# Altium schematic sheet Top.SchDoc: Top
size Letter; SheetNumber: 1; SheetTotal: 1
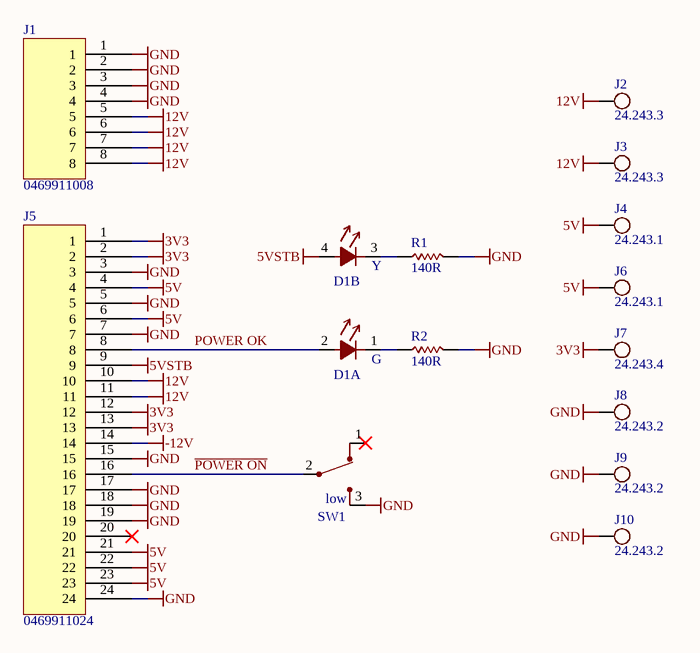
[diagram p0: Top.SchDoc]

## Parts
D1  DUAL INDICATOR 5MM  [Dialight 552-0232F]  (value not drawn)  (parts A,B of 2)
J1  0469911008  [PCIE 8P POWER]
J2  24.243.3  [BANANA YL]  (no BOM)
J3  24.243.3  [BANANA YL]  (no BOM)
J4  24.243.1  [BANANA RD]  (no BOM)
J5  0469911024  [ATX 24P POWER]
J6  24.243.1  [BANANA RD]  (no BOM)
J7  24.243.4  [BANANA GR]  (no BOM)
J8  24.243.2  [BANANA BK]  (no BOM)
J9  24.243.2  [BANANA BK]  (no BOM)
J10  24.243.2  [BANANA BK]  (no BOM)
R1  140R  [0805]
R2  140R  [0805]
SW1  SWITCH  [7101SD9AV2BE]  (value not drawn)

## Nets
3V3: J5.1 J5.2 J5.12 J5.13 J7.1(TP)
5V: J4.1(TP) J5.4 J5.6 J5.21 J5.22 J5.23 J6.1(TP)
5VSTB: D1.4 J5.9
12V: J1.5 J1.6 J1.7 J1.8 J2.1(TP) J3.1(TP) J5.10 J5.11
-12V: J5.14
GND: J1.1 J1.2 J1.3 J1.4 J5.3 J5.5 J5.7 J5.15 J5.17 J5.18 J5.19 J5.24 J8.1(TP) J9.1(TP) J10.1(TP) R1.1 R2.1 SW1.3
~{POWER ON}: J5.16 SW1.2
POWER OK: D1.2 J5.8
NetD1_1: D1.1 R2.2
NetD1_3: D1.3 R1.2

Not connected (* = marked no-connect by the designer): J5 20*; SW1 1*

## Notes on the sheet
- Project:
- Date:
- Author:
- Revision:
- Sheet
- of
- File:
- (in symbol DUAL INDICATOR 5MM, part A) G
- (in symbol DUAL INDICATOR 5MM, part B) Y
- (in symbol SWITCH) low

## Library data of the parts
D1 = DUAL INDICATOR 5MM: Dialight 552-0232F Indicator; Ref: 552-0232F
J1 = PCIE 8P: Molex MiniFit Jr 8 pin, PCIe power connector; Ref: 0469911008
J2 J3 = BANANA YELLOW: Banana jack, PCB mount right angle; Ref: 24.243.3
J4 J6 = BANANA RED: Banana jack, PCB mount right angle; Ref: 24.243.1
J5 = ATX 24P: Molex MiniFit Jr 24 pin, ATX power connector; Ref: 0469911024
J7 = BANANA GREEN: Banana jack, PCB mount right angle; Ref: 24.243.4
J8-J10 = BANANA BLACK: Banana jack, PCB mount right angle; Ref: 24.243.2
R1 R2 = RES 0805: 805 Resistor; Value: 140R
SW1 = SWITCH: Right-Angle Toogle Switch; Ref: 7101SD9AV2BE, 100SP1T2B4M7QE